# EasyEDA Pro project PWM_Haptics_Address_Selector.eprj

# Schematic Schematic1
Create Date: 2022-09-20; Page Name: P1; Project Name: PWM_Haptics_Address_Selector; Schematic Name: Schematic1; Update Date: 2022-09-20
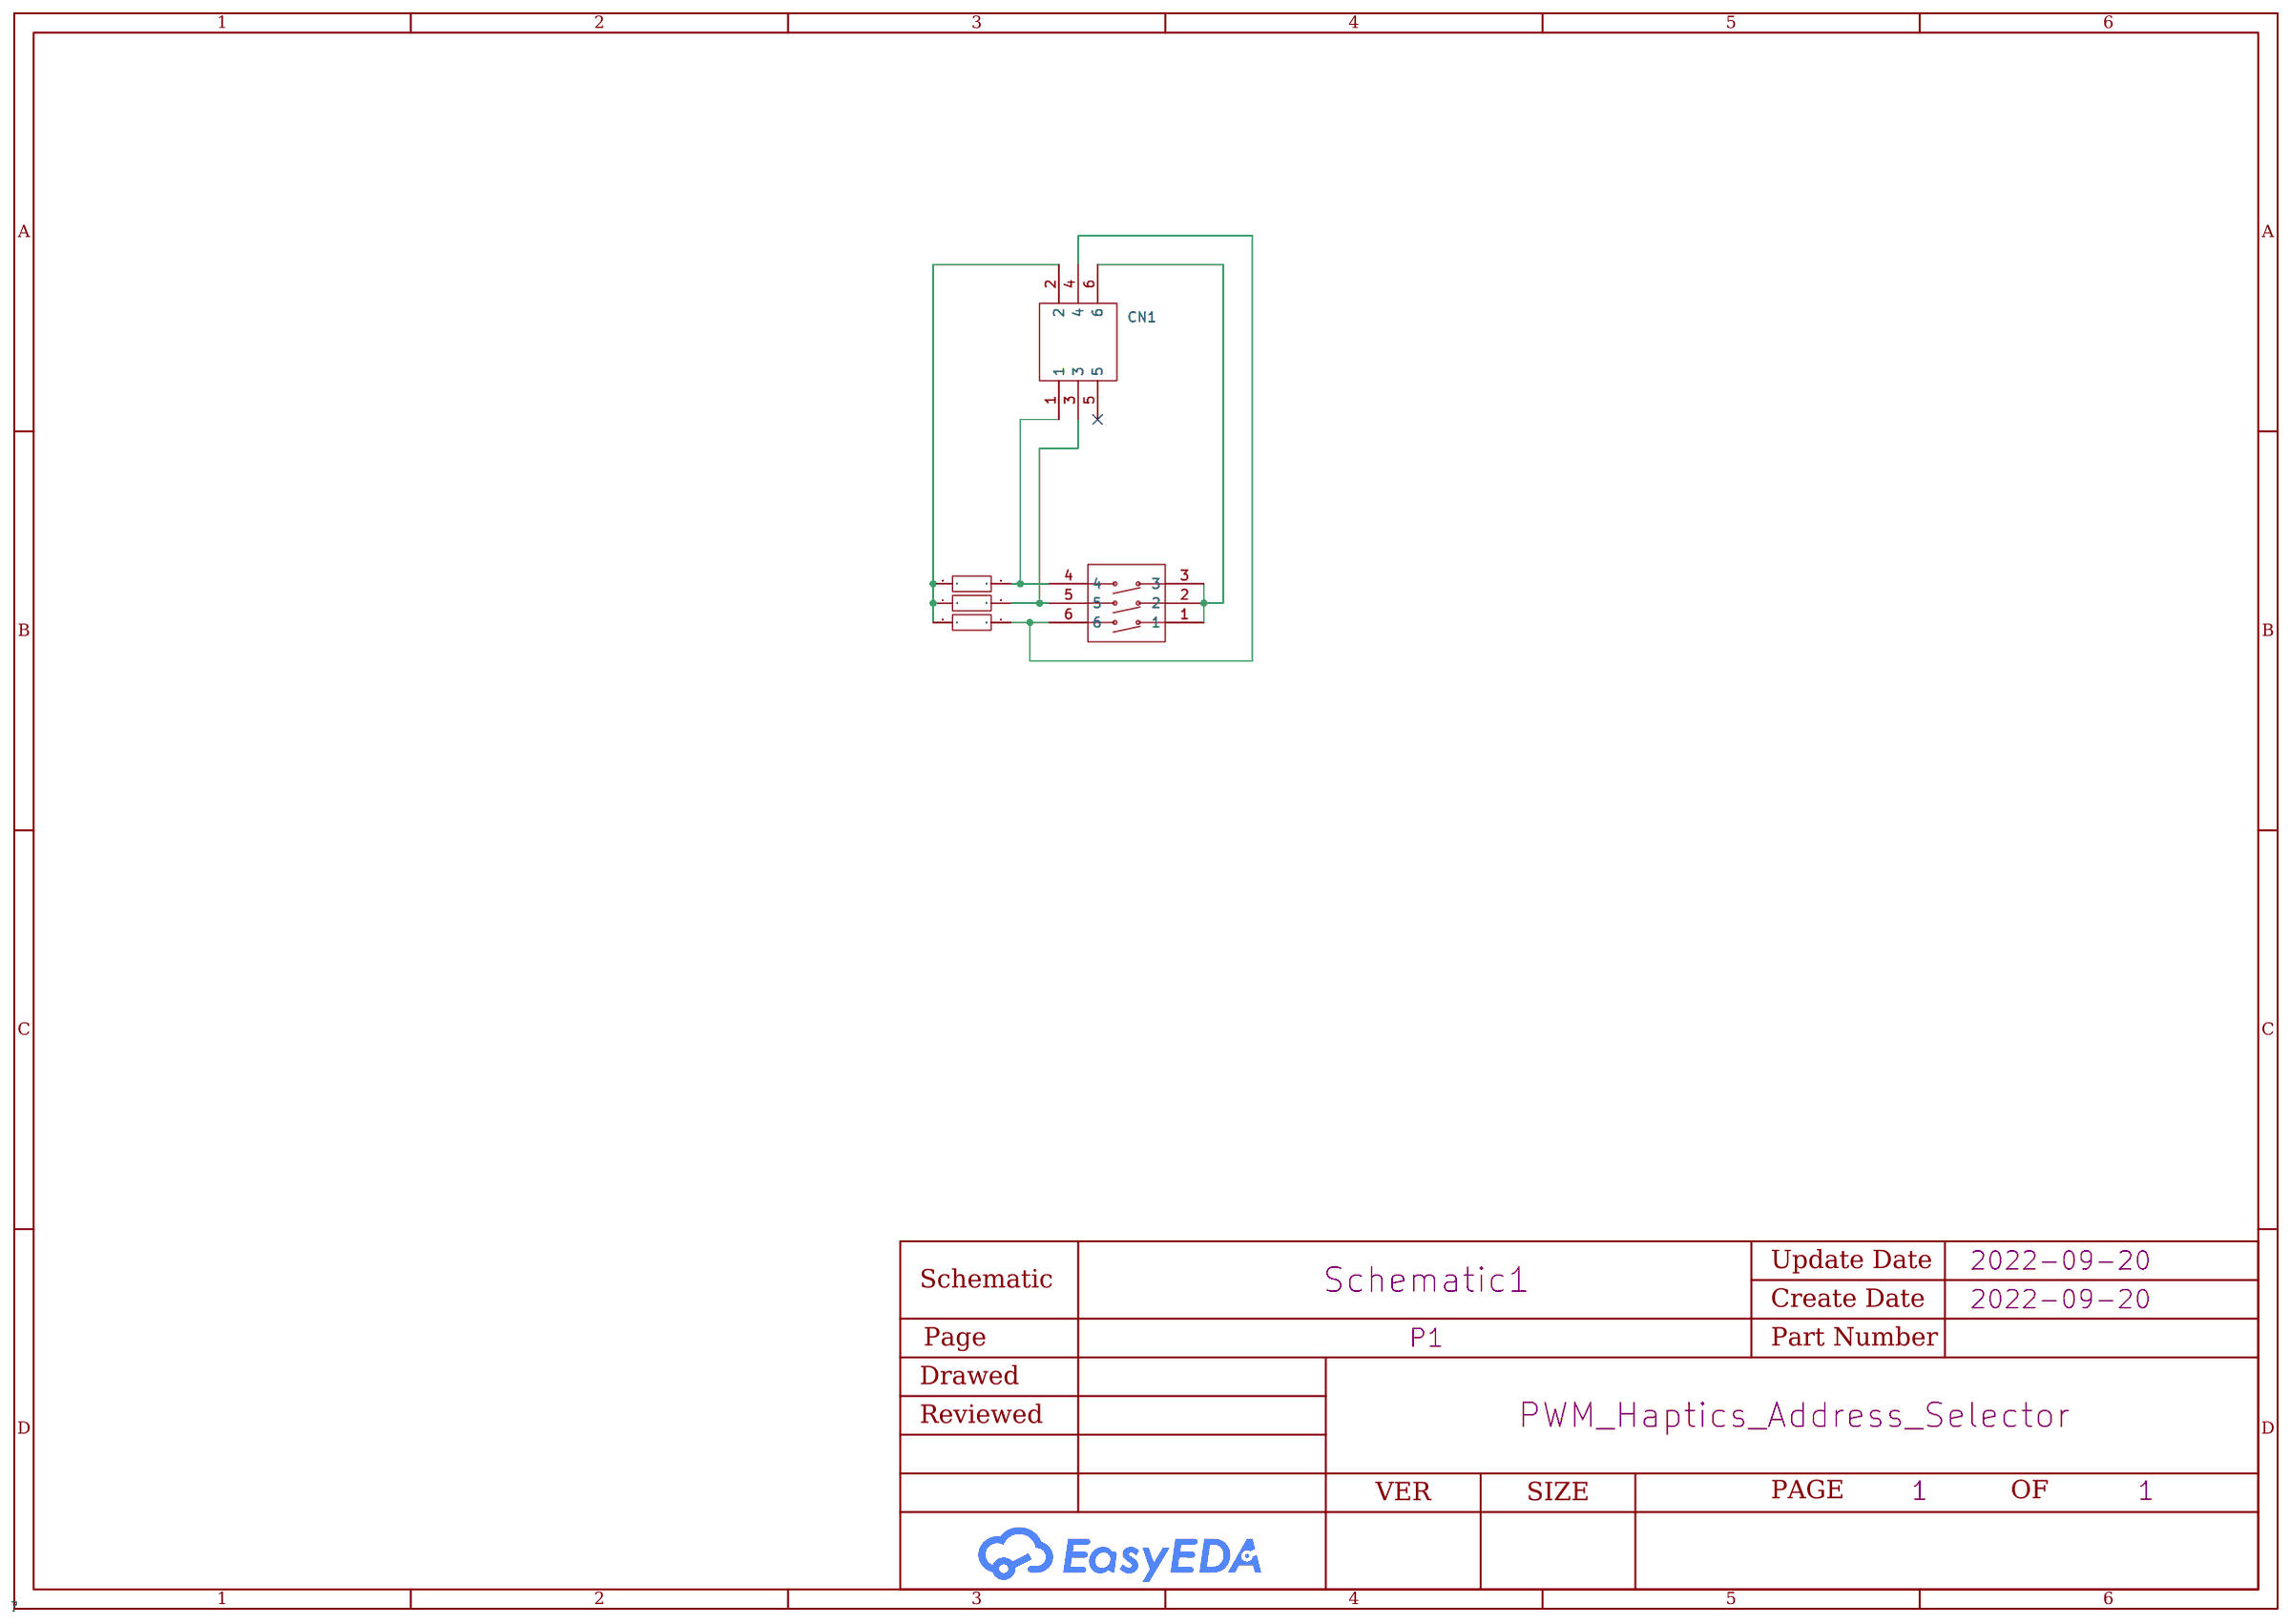
[diagram p0: schematic sheet]

## Parts
CN1  -  [CONN-TH_FC-2X3P-2.54MM]
R1  1kΩ  [R0603]
R2  1kΩ  [R0603]
R3  1kΩ  [R0603]
SW1  EM-03KP  [SW-SMD_EM-03KP]

## Library data of the parts
CN1 = 2.54-2*3P压线头: 连接器类型:IDC连接器;间距:2.54mm;每排PIN数:3;排数:2;行距:2.54mm;封装形式:三件式(连接器+压排+反折盖);触头材质:黄铜;触头镀层:金;; LCSC Part Name: 2.54mm 每排P数:3 排数:2 三件套; Supplier Part: C33344; Manufacturer: BOOMELE(博穆精密); Supplier Footprint: P=2.54mm; JLCPCB Part Class: Extended Part; Datasheet: https://atta.szlcsc.com/upload/public/pdf/source/20151118/1457707580129.pdf; Supplier: LCSC; Connector Type: IDC连接器; Pitch: 2.54mm; Pin Number in each Row: 3; Number of Rows: 2; Row Spacing: 2.54mm; Holder Type: 三件式(连接器+压排+反折盖); Contact Material: 黄铜; Contact Plating: 金
R1-R3 = 0603WAF1001T5E: 电阻类型:厚膜电阻;阻值:1kΩ;精度:±1%;功率:1/10W;温度系数:±100ppm/;最大工作电压:75V;工作温度范围:-55~+155;; LCSC Part Name: 1kΩ ±1%; Supplier Part: C21190; Manufacturer: UNI-ROYAL(厚声); Supplier Footprint: 0603; JLCPCB Part Class: Basic Part; Datasheet: https://atta.szlcsc.com/upload/public/pdf/source/20200306/C422600_1E6D84923E4A46A82E41ADD87F860B5C.pdf; Supplier: LCSC; Type: 厚膜电阻; Tolerance: ±1%; Power(Watts): 1/10W; Temperature Coefficient: ±100ppm/; Overload Voltage (Max): 75V; Operating Temperature Range: -55~+155
SW1 = EM-03KP: link: https://item.szlcsc.com/140371.html; 3DModel: SW-SMD_EM-03KP-L8.6-W6.3-H4.8-P2.54-LS10.0; Supplier: LCSC; Manufacturer: HRO; Supplier Part: C129079; JLCPCB Part Class: Extended Part

## Nets
$1N727: CN1.6 SW1.1 SW1.2 SW1.3
$1N1760: CN1.2 R1.2 R2.2 R3.1
$1N1803: CN1.1 R2.1 SW1.4
$1N1809: CN1.3 R3.2 SW1.5
$1N1815: CN1.4 R1.1 SW1.6

Not connected (* = marked no-connect by the designer): CN1 5*

# Board PCB1
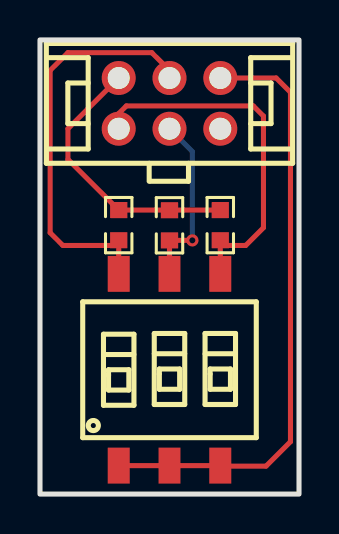
[diagram p1: board, top side]
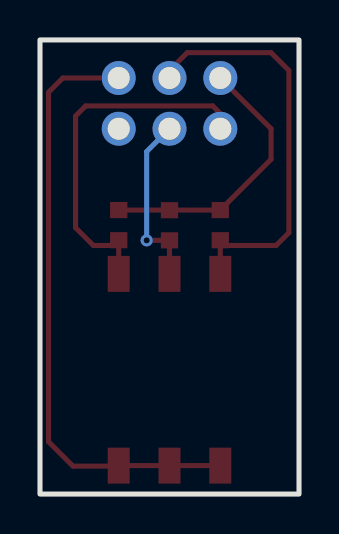
[diagram p2: board, bottom side, seen from below]

Outline 12.95 x 22.73 mm; copper layers: Top Layer, Bottom Layer. Coordinates in mm from the lower left corner of the outline.
Outline path: rectangle 0,22.73 12.95,0
Stack: Top Layer 0.035mm / Dielectric1 1.51mm FR4 er 4.5 / Bottom Layer 0.035mm

## Design rules (mm)
spacing safeClearance (default): track to track 0.152, other pairs 0.152 to 0.3
track width trackWidth (default): min 0.127, default 0.254, max 2.54
differential pair differentialPair (default): width min 0.127, default 0.254, max 2.54; gap min 0.152, default 0.152
via viaSize (default): diameter min 0.5, default 0.61, max 10; hole min 0.3, default 0.305, max 6

## Placement (name value [footprint] x y rotation side)
CN1  -  [CONN-TH_FC-2X3P-2.54MM]  6.48 19.56 0 top
R1  1kΩ  [R0603]  3.94 13.46 90 top
R2  1kΩ  [R0603]  9.02 13.46 90 top
R3  1kΩ  [R0603]  6.48 13.45 270 top
SW1  EM-03KP  [SW-SMD_EM-03KP]  6.48 6.22 0 top

## Footprints (pads in the part's own frame, mm; a bottom-side part is the same pattern mirrored in y, then rotated)
CONN-TH_FC-2X3P-2.54MM
  round 1.7 hole 1.1: 1(-2.54,-1.27) 2(-2.54,1.27) 3(0,-1.27) 4(0,1.27) 5(2.54,-1.27) 6(2.54,1.27)
R0603
  rect 0.807x0.864 smd: 1(-0.754,0) 2(0.754,0)
SW-SMD_EM-03KP
  rect 1.1x1.8 smd: 1(-2.54,-4.8) 2(0,-4.8) 3(2.54,-4.8) 4(2.54,4.8) 5(0,4.8) 6(-2.54,4.8)

## Nets
As in the schematic.

Pads without a net: CN1 5

## Via types
v1: diameter 0.61, hole 0.305, Top Layer to Bottom Layer, 1 via

## Routing (per net, layer and track width the routed paths; a pad name or vN(x,y) marks a point on that pad's centre or on a via; arc(x,y) is an arc through that point)
$1N727: length 30.4
  Top Layer w0.254: SW1.1 SW1.2 SW1.3 9.04,1.4 11.3,1.4 12.53,2.62 12.53,20.11 11.81,20.83 9.02,20.83
$1N1760: length 13.8
  Top Layer w0.254: 3.94,20.83 1.4,18.29 1.4,16.76 R1.2 6.47,14.22 R3.1 6.48,14.22 R2.2
$1N1803: length 18.2
  Top Layer w0.254: 9.02,12.47 R2.1 ; 9.02,12.47 SW1.4 ; 9.02,12.47 9.04,12.45 10.29,12.45 11.18,13.33 11.18,18.92 10.67,19.43 4.32,19.43 3.94,19.05 CN1.1
$1N1809: length 8.9
  Top Layer w0.254: v1(7.62,12.7) R3.2 SW1.5
  Bottom Layer w0.254: CN1.3 7.62,17.14 v1(7.62,12.7)
$1N1815: length 20.7
  Top Layer w0.254: SW1.6 R1.1 3.68,12.45 1.14,12.45 0.51,13.08 0.51,21.21 1.4,22.1 5.59,22.1 6.48,21.21 6.48,20.83
